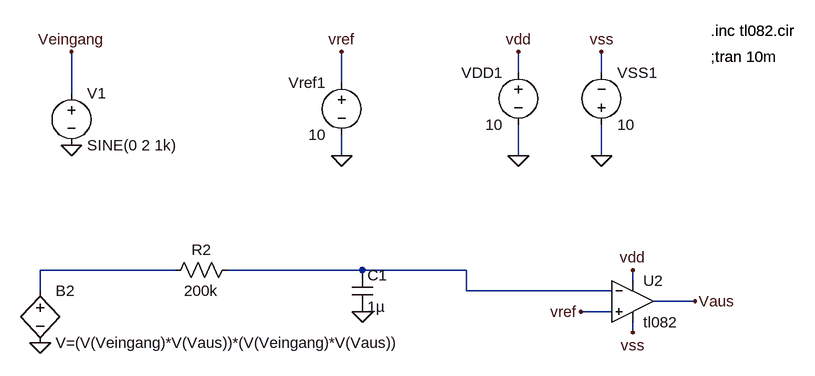
[diagram p0: schematic Draft1.asc]
Draft1.asc, the LTspice schematic file:
Version 4
SHEET 1 880 680
WIRE 128 -352 128 -384
WIRE 256 -352 256 -384
WIRE -144 -336 -144 -384
WIRE -560 -320 -560 -384
WIRE -144 -224 -144 -256
WIRE 128 -224 128 -272
WIRE 256 -224 256 -272
WIRE -400 -48 -608 -48
WIRE -112 -48 -320 -48
WIRE 48 -48 -112 -48
WIRE 304 -32 304 -48
WIRE -608 -16 -608 -48
WIRE 48 -16 48 -48
WIRE 272 -16 48 -16
WIRE 400 0 336 0
WIRE 272 16 224 16
WIRE 304 48 304 32
FLAG -560 -384 Veingang
FLAG 400 0 Vaus
FLAG 128 -224 0
FLAG 256 -224 0
FLAG 128 -384 vdd
FLAG 256 -384 vss
FLAG -144 -224 0
FLAG -144 -384 vref
FLAG 304 -48 vdd
FLAG 304 48 vss
FLAG 224 16 vref
FLAG -112 16 0
FLAG -560 -240 0
FLAG -608 64 0
SYMBOL voltage -560 -336 R0
WINDOW 123 0 0 Left 2
WINDOW 39 0 0 Left 2
SYMATTR InstName V1
SYMATTR Value SINE(0 2 1k)
SYMBOL voltage 128 -368 M0
SYMATTR InstName VDD1
SYMATTR Value 10
SYMBOL voltage 256 -256 M180
WINDOW 0 24 96 Left 2
WINDOW 3 24 16 Left 2
SYMATTR InstName VSS1
SYMATTR Value 10
SYMBOL voltage -144 -352 M0
WINDOW 123 0 0 Left 2
WINDOW 39 0 0 Left 2
SYMATTR InstName Vref1
SYMATTR Value 10
SYMBOL res -304 -64 R90
WINDOW 0 0 56 VBottom 2
WINDOW 3 32 56 VTop 2
SYMATTR InstName R2
SYMATTR Value 200k
SYMBOL cap -128 -48 R0
SYMATTR InstName C1
SYMATTR Value 1µ
SYMBOL bv -608 -32 R0
SYMATTR InstName B2
SYMATTR Value V=(V(Veingang)*V(Vaus))*(V(Veingang)*V(Vaus))
SYMBOL Opamps\\opamp2 304 -64 R0
SYMATTR InstName U2
SYMATTR Value tl082
TEXT 424 -416 Left 2 !.inc tl082.cir
TEXT 424 -376 Left 2 !.tran 10m
TEXT 424 -416 Left 2 !.inc tl082.cir
TEXT 424 -376 Left 2 !;tran 10

The netlist it stands for:
* Draft1.asc
V1 Veingang 0 SINE(0 2 1k)
VDD1 vdd 0 10
VSS1 0 vss 10
Vref1 vref 0 10
R2 N002 N001 200k
C1 N002 0 1µ
B2 N001 0 V=(V(Veingang)*V(Vaus))*(V(Veingang)*V(Vaus))
XU2 vref N002 vdd vss Vaus tl082  ; pins In+ In- V+ V- OUT
.inc tl082.cir
.tran 10m
.inc tl082.cir
;tran 10
.backanno
.end